# Altium schematic sheet CPU_superviser.SchDoc: UNUSED INTERFACES
size A3; Engineer: M.GUENI; Revision: R0; SheetNumber: 10; SheetTotal: 10
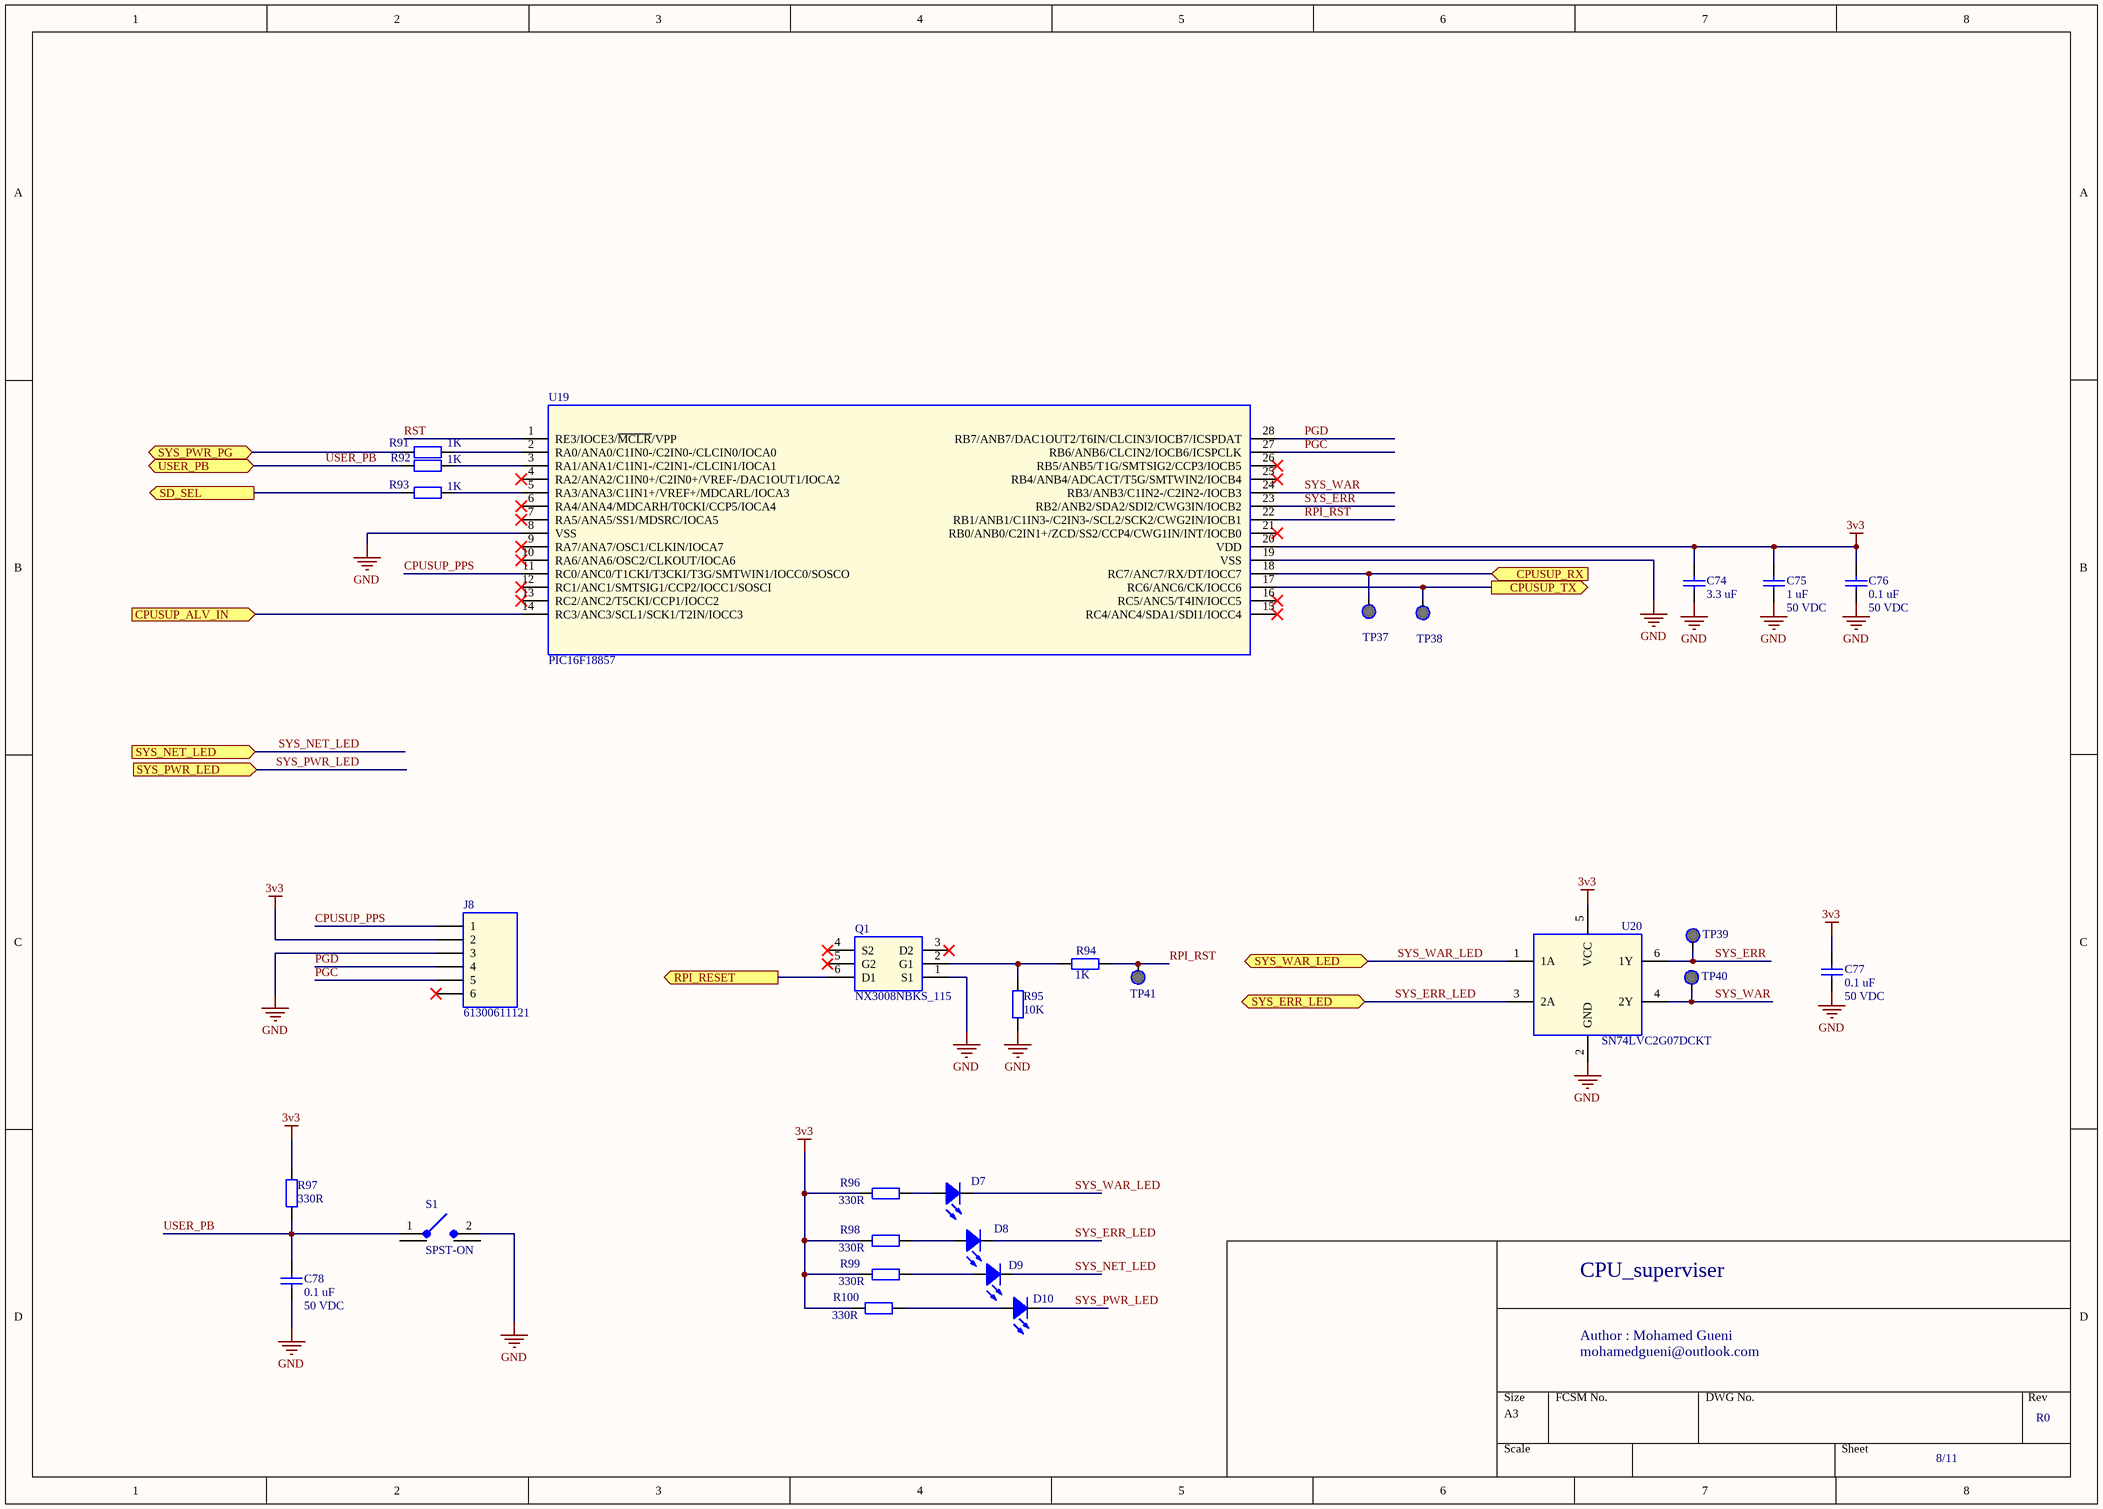
[diagram p0: CPU_superviser.SchDoc]

## Parts
C74  Value 1: 3.3 uF  [CAPC1608N]  (hidden comment: Capacitor)
C75  Value 1: 1 uF  Value 2: 50 VDC  [CAPC1608N]  (hidden comment: Capacitor)
C76  Value 1: 0.1 uF  Value 2: 50 VDC  [CAPC1608N]  (hidden comment: Capacitor)
C77  Value 1: 0.1 uF  Value 2: 50 VDC  [CAPC1608N]  (hidden comment: Capacitor)
C78  Value 1: 0.1 uF  Value 2: 50 VDC  [CAPC1608N]  (hidden comment: Capacitor)
D7  150060BS75000  [LED0603]  (value not drawn)
D8  150060RS75000  [LED0603]  (value not drawn)
D9  150060GS75000  [LED0603]  (value not drawn)
D10  150060GS75000  [LED0603]  (value not drawn)
J8  61300611121  [HDRV6W64P0X254]
Q1  NX3008NBKS_115  [SOT65P210X110-6N]
R91  Value 1: 1K  [RESC1608N]  (hidden comment: Resistor)
R92  Value 1: 1K  [RESC1608N]  (hidden comment: Resistor)
R93  Value 1: 1K  [RESC1608N]  (hidden comment: Resistor)
R94  Value 1: 1K  [RESC1608N]  (hidden comment: Resistor)
R95  Value 1: 10K  [RESC1608N]  (hidden comment: Resistor)
R96  Value 1: 330R  [RESC1608N]  (hidden comment: Resistor)
R97  Value 1: 330R  [RESC1608N]  (hidden comment: Resistor)
R98  Value 1: 330R  [RESC1608N]  (hidden comment: Resistor)
R99  Value 1: 330R  [RESC1608N]  (hidden comment: Resistor)
R100  Value 1: 330R  [RESC1608N]  (hidden comment: Resistor)
S1  SPST-ON  [118250272]
TP37  Test Point  [TP]  (value not drawn)  (no BOM)
TP38  Test Point  [TP]  (value not drawn)  (no BOM)
TP39  Test Point  [TP]  (value not drawn)  (no BOM)
TP40  Test Point  [TP]  (value not drawn)  (no BOM)
TP41  Test Point  [TP]  (value not drawn)  (no BOM)
U19  PIC16F18857  [SOP65P780X200-28N]
U20  SN74LVC2G07DCKT  [SOT65P210X1106N]

## Ports
CPUSUP_ALV_IN (in), CPUSUP_RX (in), CPUSUP_TX (out), RPI_RESET (out), SD_SEL (out), SYS_ERR_LED (bidir), SYS_NET_LED (in), SYS_PWR_LED (in), SYS_PWR_PG (bidir), SYS_WAR_LED (bidir), USER_PB (bidir)

## Nets
3v3: C74.2 C75.2 C76.2 C77.2 J8.2 R96.1 R97.2 R98.1 R99.1 R100.1 U19.20(VDD) U20.5(VCC)
GND: C74.1 C75.1 C76.1 C77.1 C78.1 J8.3 Q1.1(S1) R95.1 S1.2(NO) U19.8(VSS) U19.19(VSS) U20.2(GND)
CPUSUP_ALV_IN: U19.14(RC3/ANC3/SCL1/SCK1/T2IN/IOCC3) ; port CPUSUP_ALV_IN
CPUSUP_PPS: J8.1 U19.11(RC0/ANC0/T1CKI/T3CKI/T3G/SMTWIN1/IOCC0/SOSCO)
CPUSUP_RX: TP37.1 U19.18(RC7/ANC7/RX/DT/IOCC7) ; port CPUSUP_RX
CPUSUP_TX: TP38.1 U19.17(RC6/ANC6/CK/IOCC6) ; port CPUSUP_TX
PGC: J8.5 U19.27(RB6/ANB6/CLCIN2/IOCB6/ICSPCLK)
PGD: J8.4 U19.28(RB7/ANB7/DAC1OUT2/T6IN/CLCIN3/IOCB7/ICSPDAT)
RPI_RESET: Q1.6(D1) ; port RPI_RESET
RPI_RST: R94.2 TP41.1 U19.22(RB1/ANB1/C1IN3-/C2IN3-/SCL2/SCK2/CWG2IN/IOCB1)
RST: U19.1(RE3/IOCE3/~{MCLR}/VPP)
SD_SEL: R93.1 ; port SD_SEL
SYS_ERR: TP39.1 U19.23(RB2/ANB2/SDA2/SDI2/CWG3IN/IOCB2) U20.6(1Y)
SYS_ERR_LED: D8.1(K) U20.3(2A) ; port SYS_ERR_LED
SYS_NET_LED: D9.1(K) ; port SYS_NET_LED
SYS_PWR_LED: D10.1(K) ; port SYS_PWR_LED
SYS_PWR_PG: R91.1 ; port SYS_PWR_PG
SYS_WAR: TP40.1 U19.24(RB3/ANB3/C1IN2-/C2IN2-/IOCB3) U20.4(2Y)
SYS_WAR_LED: D7.1(K) U20.1(1A) ; port SYS_WAR_LED
USER_PB: C78.2 R92.1 R97.1 S1.1(COM) ; port USER_PB
NetD7_2: D7.2(A) R96.2
NetD8_2: D8.2(A) R98.2
NetD9_2: D9.2(A) R99.2
NetD10_2: D10.2(A) R100.2
NetQ1_2: Q1.2(G1) R94.1 R95.2
NetR91_2: R91.2 U19.2(RA0/ANA0/C1IN0-/C2IN0-/CLCIN0/IOCA0)
NetR92_2: R92.2 U19.3(RA1/ANA1/C1IN1-/C2IN1-/CLCIN1/IOCA1)
NetR93_2: R93.2 U19.5(RA3/ANA3/C1IN1+/VREF+/MDCARL/IOCA3)

Not connected (* = marked no-connect by the designer): J8 6*; Q1 3(D2)* 4(S2)* 5(G2)*; S1 MH1 MH2; U19 4(RA2/ANA2/C1IN0+/C2IN0+/VREF-/DAC1OUT1/IOCA2)* 6(RA4/ANA4/MDCARH/T0CKI/CCP5/IOCA4)* 7(RA5/ANA5/SS1/MDSRC/IOCA5)* 9(RA7/ANA7/OSC1/CLKIN/IOCA7)* 10(RA6/ANA6/OSC2/CLKOUT/IOCA6)* 12(RC1/ANC1/SMTSIG1/CCP2/IOCC1/SOSCI)* 13(RC2/ANC2/T5CKI/CCP1/IOCC2)* 15(RC4/ANC4/SDA1/SDI1/IOCC4)* 16(RC5/ANC5/T4IN/IOCC5)* 21(RB0/ANB0/C2IN1+/ZCD/SS2/CCP4/CWG1IN/INT/IOCB0)* 25(RB4/ANB4/ADCACT/T5G/SMTWIN2/IOCB4)* 26(RB5/ANB5/T1G/SMTSIG2/CCP3/IOCB5)*

## Notes on the sheet
- CPU_superviser
- Author : Mohamed Gueni
- mohamedgueni@outlook.com
- 8/11
- R0
- Title:
- Micro Device Tunisie
- Size:
- Date:
- File:
- A3
- Engineer :
- Revision:
- Sheet
- of
- Cyber Parc  Hammam Sousse
- Avenue Charles De Gaulle
- 4011, Hammam-Sousse, Tunisie
- contact@mdtunisie.com

## Library data of the parts
C74 = CAP-000000008: FTP: 0603; Part Number: CAP-000000008
C75 = CAP-000000005: MAN: KEMET; MANREF: C0603C105K8PACTU; DES: Multilayer Ceramic Capacitors MLCC - SMD/SMT 10v 1uF X5R 0603 10%; TOL: 10 %; FTP: 0603; SUP: Mouser; SUPREF: 80-C0603C105K8P; NOTE: _; Part Number: CAP-000000005
C76-C78 = CAP-000000003: MAN: KEMET; MANREF: C0603C104M5RAC; DES: Multilayer Ceramic Capacitors MLCC - SMD/SMT 50V 0.1uF 0603 X7R 20%; TOL: 20 %; FTP: 0603; SUP: Mouser; SUPREF: 80-C0603C104M5RAC; NOTE: _; Part Number: CAP-000000003
D7 = LED-000000003: MAN: Wurth Elektronik; DES: Standard LEDs - SMD WL-SMCW SMDMono TpVw Waterclr 0603 Blue; Value 1: 0.02A; Value 2: 3.2 V; TOL: _; FTP: 0603; SUP: Mouser; SUPREF: 710-150060BS75000; Part Number: LED-000000003; MANREF: 150060BS75000; NOTE: _
D8 = LED-000000001: MAN: Wurth Elektronik; DES: Standard LEDs - SMD WL-SMCW SMDMono TpVw Waterclr 0603 Red; Value 1: 0.02A; Value 2: 2 V; TOL: _; FTP: 0603; SUP: Mouser; SUPREF: 710-150060RS75000; Part Number: LED-000000001; MANREF: 150060RS75000; NOTE: _
D9 D10 = LED-000000002: MAN: Wurth Elektronik; DES: Standard LEDs - SMD WL-SMCW SMDMono TpVw Waterclr 0603 Green; Value 1: 0.02A; Value 2: 3.2 V; TOL: _; FTP: 0603; SUP: Mouser; SUPREF: 710-150060GS75000; Part Number: LED-000000002; MANREF: 150060GS75000; NOTE: _
J8 = CON-000000010: MAN: Wurth Elektronik; DES: Headers & Wire Housings WR-PHD 2.54mm 6Pin T HT Header; Value 1: _; FTP: THT; SUP: Mouser; SUPREF: 710-61300611121; Part Number: CON-000000010; MANREF: 61300611121; Value 2: _; TOL: _; NOTE: _
Q1 = TRM-000000002: MAN: Nexperia; MANREF: NX3008NBKS,115; DES: MOSFETs 30 V, 350 mA dual N-channel Trench MOSFET; Value 1: 350 mA; Value 2: 30V; TOL: _; FTP: TSSOP-6; SUP: Mouser; SUPREF: 771-NX3008NBKS,115; Part Number: TRM-000000002; NOTE: -
R91-R94 = RES-000000001: MAN: KOA Speer; MANREF: RN731JTTD1001F25; DES: Thin Film Resistors - SMD 1kOhm,0603,1%,25ppm, 63mW,50V; Value 2: 0.63W; TOL: 1%; FTP: 0603; SUP: Mouser; SUPREF: 660-RN731JTTD1001F25; NOTE: _; Part Number: RES-000000001
R95 = RES-000000007: MAN: KOA Speer; MANREF: RN731JTTD1002F25; DES: Thin Film Resistors - SMD 10kOhm,0603,1%,25ppm ,63mW,50V; Value 2: 0.63W; TOL: 1%; FTP: 0603; SUP: Mouser; SUPREF: 660-RN731JTTD1002F25; NOTE: _; Part Number: RES-000000007
R96-R100 = RES-000000008: MAN: KOA Speer; SUP: Mouser; NOTE: _; Part Number: RES-000000008
S1 = S-000000001: MAN: TE Connectivity / P&B; MANREF: 1-1825027-2; DES: Tactile Switches R/A TACT 260 PB SWITCH; Value 1: 50 mA; Value 2: 24 VDC; SUP: Mouser; SUPREF: 506-1-1825027-2; Part Number: S-000000001; NOTE: -
TP37-TP41 = MIS-000000002: MAN: _; Part Number: MIS-000000002; MANREF: _; DES: _; Value 1: _; Value 2: _; TOL: _; FTP: _; SUP: _; SUPREF: _; NOTE: _
U19 = MCU-000000002: MAN: Microchip Technology; MANREF: PIC16F18857T-I/SS; DES: 8-bit Microcontrollers - MCU 8-Bit MCU 56KB Flash 4KB RAM 256B EE CIP; Value 1: _; FTP: SSOP-28; SUP: Mouser; SUPREF: 579-PIC16F18857TI/SS; Part Number: MCU-000000002; Value 2: _; TOL: _; NOTE: _
U20 = GIC-000000009: Dual Buffer/Driver with Open-Drain Output; Manufacturer_Name: Texas Instruments; Geometry.Height: 1.1mm; DES: Buffers & Line Drivers Dual Buffer Driver A 595-SN74LVC2G07DCKR; Value 1: 5.5 V; Value 2: 32 mA; TOL: _; FTP: SOT-353-SC70-6; SUP: Mouser; SUPREF: 595-SN74LVC2G07DCKT; Mouser Part Number: 595-SN74LVC2G07DCKT; Mouser Price/Stock: https://www.mouser.co.uk/ProductDetail/Texas-Instruments/SN74LVC2G07DCKT?qs=pajgIaoyDUh%252B8BjKWdvxSw%3D%3D; Manufacturer_Part_Number: SN74LVC2G07DCKT; Datasheet Link: http://www.ti.com/lit/gpn/SN74LVC2G07; Part Number: GIC-000000009; MAN: Texas Instruments; MANREF: SN74LVC2G07DCKT; NOTE: _